# Altium schematic sheet BLUETOOTH_UNIT.SchDoc
size A4
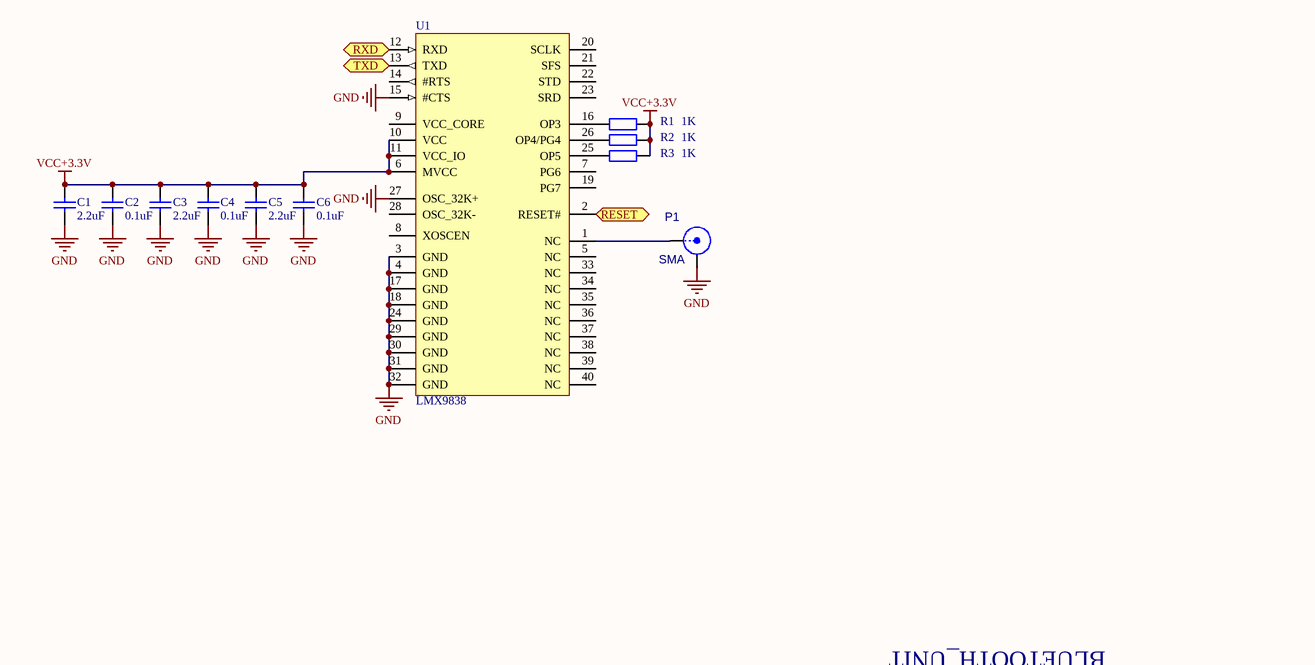
[diagram p0: BLUETOOTH_UNIT.SchDoc]

## Parts
C1  value 2.2uF  [C0603]  (hidden comment: 0805)
C2  value 0.1uF  [C0603]  (hidden comment: 0805)
C3  value 2.2uF  [C0603]  (hidden comment: 0805)
C4  value 0.1uF  [C0603]  (hidden comment: 0805)
C5  value 2.2uF  [C0603]  (hidden comment: 0805)
C6  value 0.1uF  [C0603]  (hidden comment: 0805)
P1  SMA  [SMA]
R1  value 1K  [C0603]  (hidden comment: RES)
R2  value 1K  [C0603]  (hidden comment: RES)
R3  value 1K  [C0603]  (hidden comment: RES)
U1  LMX9838  [LMX9838]

## Ports
RESET (in), RXD (in), TXD (out)

## Nets
GND: C1.2 C2.2 C3.2 C4.2 C5.2 C6.2 P1.2(Y) U1.3(GND) U1.4(GND) U1.15(#CTS) U1.17(GND) U1.18(GND) U1.24(GND) U1.27(OSC_32K+) U1.29(GND) U1.30(GND) U1.31(GND) U1.32(GND)
VCC+3.3V: C1.1 C2.1 C3.1 C4.1 C5.1 C6.1 R1.2 R2.2 R3.2 U1.6(MVCC) U1.10(VCC) U1.11(VCC_IO)
RESET: U1.2(RESET#) ; port RESET
RXD: U1.12(RXD) ; port RXD
TXD: U1.13(TXD) ; port TXD
NetP1_1: P1.1(X) U1.1(NC)
NetR1_1: R1.1 U1.16(OP3)
NetR2_1: R2.1 U1.26(OP4/PG4)
NetR3_1: R3.1 U1.25(OP5)

Not connected (* = marked no-connect by the designer): U1 5(NC) 7(PG6) 8(XOSCEN) 9(VCC_CORE) 14(#RTS) 19(PG7) 20(SCLK) 21(SFS) 22(STD) 23(SRD) 28(OSC_32K-) 33(NC) 34(NC) 35(NC) 36(NC) 37(NC) 38(NC) 39(NC) 40(NC)

## Notes on the sheet
- BLUETOOTH_UNIT

## Library data of the parts
C1-C6 = Capasitor_SMD_0805: Capasitor_SMD_0808/
R1-R3 = RES: Resistor
U1 = LMX9838: Bluetooth module
P1 = SMA: LatestRevisionDate: 17-Jul-2002; Publisher: Altium Limited; LatestRevisionNote: Re-released for DXP Platform.; Value: *